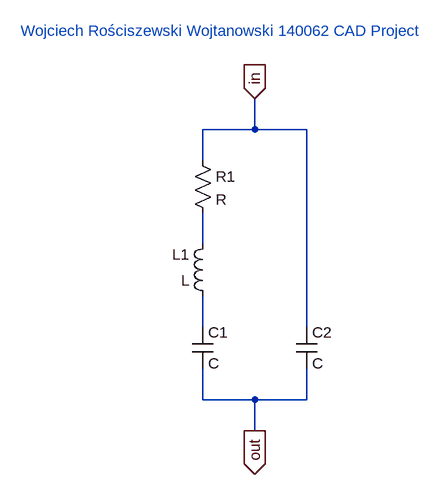
[diagram p0: schematic Draft1.asc]
Draft1.asc, the LTspice schematic file:
Version 4
SHEET 1 880 680
WIRE 240 112 240 64
WIRE 240 112 160 112
WIRE 320 112 240 112
WIRE 160 160 160 112
WIRE 160 288 160 240
WIRE 160 416 160 368
WIRE 320 416 320 112
WIRE 160 528 160 480
WIRE 240 528 160 528
WIRE 320 528 320 480
WIRE 320 528 240 528
WIRE 240 576 240 528
FLAG 240 64 in
IOPIN 240 64 In
FLAG 240 576 out
IOPIN 240 576 Out
SYMBOL res 144 144 R0
SYMATTR InstName R1
SYMBOL ind 176 384 R180
WINDOW 0 36 80 Left 2
WINDOW 3 36 40 Left 2
SYMATTR InstName L1
SYMBOL cap 144 416 R0
SYMATTR InstName C1
SYMBOL cap 304 416 R0
SYMATTR InstName C2
TEXT -120 -40 Left 2 ;Wojciech Rościszewski Wojtanowski 140062 CAD Project

The netlist it stands for:
* Draft1.asc
R1 in N001 R
L1 N002 N001 L
C1 N002 out C
C2 in out C
* Wojciech Rościszewski Wojtanowski 140062 CAD Project
.backanno
.end